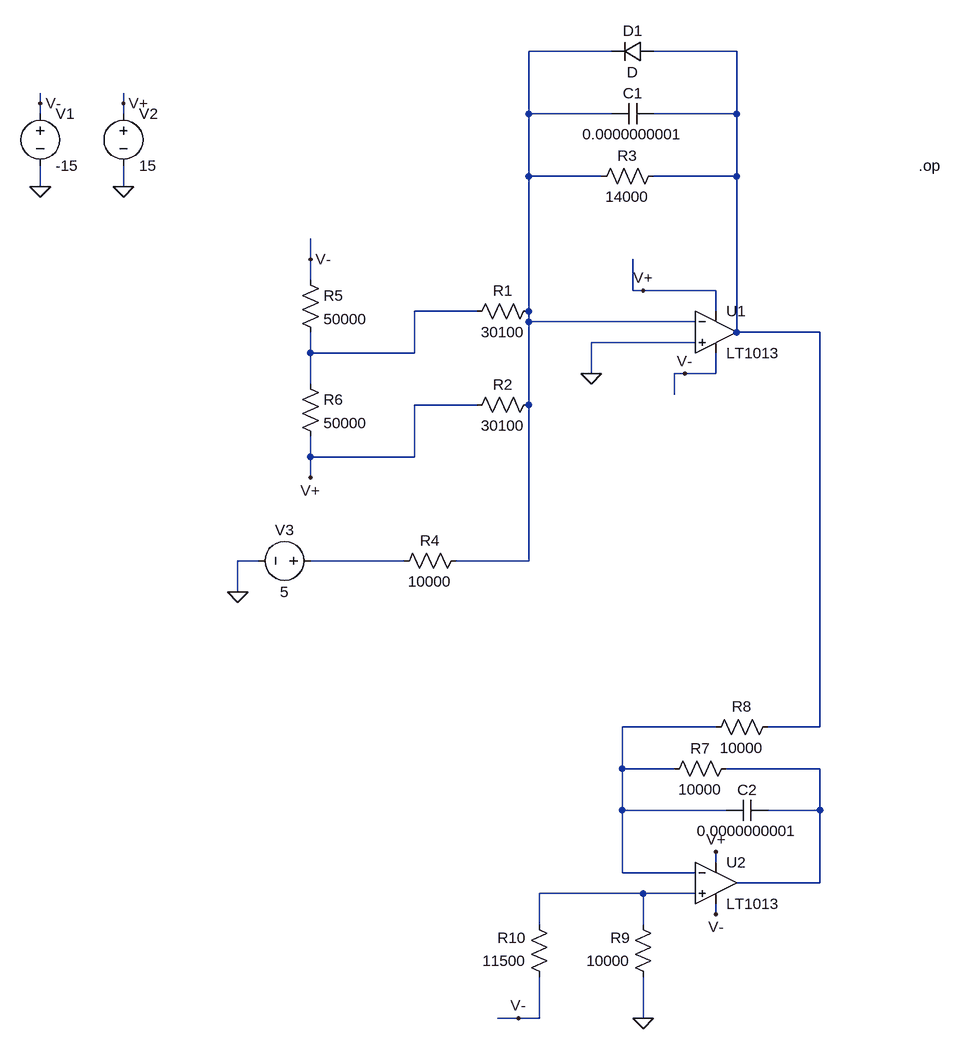
[diagram p0: schematic fadex4u fade cv.asc]
fadex4u fade cv.asc, the LTspice schematic file:
Version 4
SHEET 1 880 1352
WIRE 32 -224 -96 -224
WIRE 224 -224 96 -224
WIRE -848 -144 -848 -160
WIRE -720 -144 -720 -160
WIRE -848 -128 -848 -144
WIRE -720 -128 -720 -144
WIRE -96 -128 -96 -224
WIRE 32 -128 -96 -128
WIRE 224 -128 224 -224
WIRE 224 -128 96 -128
WIRE -96 -32 -96 -128
WIRE 16 -32 -96 -32
WIRE 224 -32 224 -128
WIRE 224 -32 96 -32
WIRE -848 -16 -848 -48
WIRE -720 -16 -720 -48
WIRE -432 96 -432 64
WIRE -432 128 -432 96
WIRE 64 144 64 96
WIRE 80 144 64 144
WIRE 192 144 80 144
WIRE -176 176 -272 176
WIRE -96 176 -96 -32
WIRE 192 176 192 144
WIRE -96 192 -96 176
WIRE 160 192 -96 192
WIRE 224 208 224 -32
WIRE 352 208 224 208
WIRE 160 224 0 224
WIRE -432 240 -432 208
WIRE -272 240 -272 176
WIRE -272 240 -432 240
WIRE 0 272 0 224
WIRE 144 272 128 272
WIRE 192 272 192 240
WIRE 192 272 144 272
WIRE -432 288 -432 240
WIRE 128 304 128 272
WIRE -176 320 -272 320
WIRE -96 320 -96 192
WIRE -432 400 -432 368
WIRE -272 400 -272 320
WIRE -272 400 -432 400
WIRE -432 432 -432 400
WIRE -512 560 -544 560
WIRE -288 560 -432 560
WIRE -96 560 -96 320
WIRE -96 560 -208 560
WIRE -544 608 -544 560
WIRE 352 624 352 208
WIRE 192 816 48 816
WIRE 352 816 352 624
WIRE 352 816 272 816
WIRE 48 880 48 816
WIRE 128 880 48 880
WIRE 352 880 208 880
WIRE 48 944 48 880
WIRE 208 944 48 944
WIRE 352 944 352 880
WIRE 352 944 272 944
WIRE 192 1024 192 1008
WIRE 48 1040 48 944
WIRE 160 1040 48 1040
WIRE 352 1056 352 944
WIRE 352 1056 224 1056
WIRE 80 1072 -80 1072
WIRE 160 1072 80 1072
WIRE 192 1104 192 1088
WIRE -80 1120 -80 1072
WIRE 80 1120 80 1072
WIRE -112 1264 -144 1264
WIRE -80 1264 -80 1200
WIRE -80 1264 -112 1264
WIRE 80 1264 80 1200
FLAG 0 272 0
FLAG -848 -16 0
FLAG -720 -16 0
FLAG -720 -144 V+
FLAG -848 -144 V-
FLAG 80 144 V+
FLAG 144 272 V-
FLAG -432 96 V-
FLAG -432 432 V+
FLAG -544 608 0
FLAG 192 1008 V+
FLAG 192 1104 V-
FLAG 80 1264 0
FLAG -112 1264 V-
DATAFLAG 352 1056 "$"
DATAFLAG 352 624 "$"
SYMBOL Opamps/LT1013 192 144 R0
SYMATTR InstName U1
SYMBOL res -192 192 R270
WINDOW 0 32 56 VTop 2
WINDOW 3 0 56 VBottom 2
SYMATTR InstName R1
SYMATTR Value 30100
SYMBOL res -80 304 R90
WINDOW 0 0 56 VBottom 2
WINDOW 3 32 56 VTop 2
SYMATTR InstName R2
SYMATTR Value 30100
SYMBOL res 112 -48 R90
WINDOW 0 0 56 VBottom 2
WINDOW 3 32 56 VTop 2
SYMATTR InstName R3
SYMATTR Value 14000
SYMBOL res -192 544 R90
WINDOW 0 0 56 VBottom 2
WINDOW 3 32 56 VTop 2
SYMATTR InstName R4
SYMATTR Value 10000
SYMBOL voltage -848 -144 R0
SYMATTR InstName V1
SYMATTR Value -15
SYMBOL voltage -720 -144 R0
SYMATTR InstName V2
SYMATTR Value 15
SYMBOL res -448 112 R0
SYMATTR InstName R5
SYMATTR Value 50000
SYMBOL res -448 272 R0
SYMATTR InstName R6
SYMATTR Value 50000
SYMBOL voltage -416 560 R90
WINDOW 0 -32 56 VBottom 2
WINDOW 3 32 56 VTop 2
SYMATTR InstName V3
SYMATTR Value 5
SYMBOL cap 96 -144 R90
WINDOW 0 0 32 VBottom 2
WINDOW 3 32 32 VTop 2
SYMATTR InstName C1
SYMATTR Value 0.0000000001
SYMBOL diode 96 -240 R90
WINDOW 0 0 32 VBottom 2
WINDOW 3 32 32 VTop 2
SYMATTR InstName D1
SYMBOL Opamps/LT1013 192 992 R0
SYMATTR InstName U2
SYMBOL res 224 864 R90
WINDOW 0 0 56 VBottom 2
WINDOW 3 32 56 VTop 2
SYMATTR InstName R7
SYMATTR Value 10000
SYMBOL res 288 800 R90
WINDOW 0 0 56 VBottom 2
WINDOW 3 32 56 VTop 2
SYMATTR InstName R8
SYMATTR Value 10000
SYMBOL cap 272 928 R90
WINDOW 0 0 32 VBottom 2
WINDOW 3 32 32 VTop 2
SYMATTR InstName C2
SYMATTR Value 0.0000000001
SYMBOL res 96 1216 R180
WINDOW 0 36 76 Left 2
WINDOW 3 36 40 Left 2
SYMATTR InstName R9
SYMATTR Value 10000
SYMBOL res -64 1216 R180
WINDOW 0 36 76 Left 2
WINDOW 3 36 40 Left 2
SYMATTR InstName R10
SYMATTR Value 11500
TEXT 504 -48 Left 2 !.op

The netlist it stands for:
* fadex4u fade cv.asc
XU1 0 N001 V+ V- N002 LT1013  ; pins In+ In- V+ V- OUT
R1 N003 N001 30100
R2 N001 V+ 30100
R3 N002 N001 14000
R4 N001 N004 10000
V1 V- 0 -15
V2 V+ 0 15
R5 V- N003 50000
R6 N003 V+ 50000
V3 N004 0 5
C1 N002 N001 0.0000000001
D1 N002 N001 D
XU2 N007 N005 V+ V- N006 LT1013  ; pins In+ In- V+ V- OUT
R7 N006 N005 10000
R8 N002 N005 10000
C2 N006 N005 0.0000000001
R9 0 N007 10000
R10 V- N007 11500
.model D D
.lib standard.dio
.op
.lib LTC.lib
.backanno
.end